# Altium schematic sheet LSM303.SchDoc: =GlobalProjectName
size A4; ApprovedBy: Утвердил; CheckedBy: Проверил; Author: Разработал; SheetNumber: 5; SheetTotal: 10; PageSetup: Record=PageOptions|CenterHorizontal=True|CenterVertical=True|PrintScale=1.00|XCorrection=1.00|YCorrection=1.00|PrintKind=1|BorderSize=5000000|LeftOffset=0|BottomOffset=0|Orientation=2|PaperLength=1000|PaperWidth=1000|Scale=100|PaperSource=15|PrintQuality=1200|MediaType=1|DitherType=10|PaperKind=A3|PrintScaleMode=1; Weight: -; ScaleFactor: -; NormInspection: Норм.Контр.
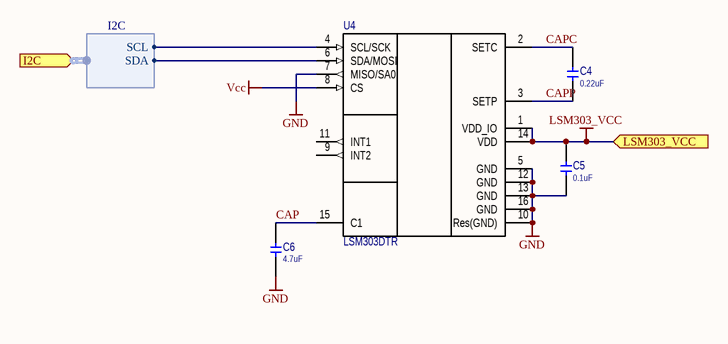
[diagram p0: LSM303.SchDoc]

## Parts
C4  value 0.22uF  [CERCAP 0402]
C5  value 0.1uF  [CERCAP 0402]
C6  value 4.7uF  [CERCAP 0603]
U4  LSM303DTR  [LGA16_LSM303DTR]

## Ports
I2C (in, harness I2C), LSM303_VCC (in)

## Harnesses
I2C: SCL, SDA

## Nets
GND: C5.1 C6.1 U4.5(GND) U4.7(MISO/SA0) U4.10(Res(GND)) U4.12(GND) U4.13(GND) U4.16(GND)
LSM303_VCC: C5.2 U4.1(VDD_IO) U4.14(VDD) ; port LSM303_VCC
Vcc: U4.8(CS)
CAP: C6.2 U4.15(C1)
CAPC: C4.2 U4.2(SETC)
CAPP: C4.1 U4.3(SETP)
NetU4_4: U4.4(SCL/SCK) ; port I2C.SCL
NetU4_6: U4.6(SDA/MOSI) ; port I2C.SDA

Not connected (* = marked no-connect by the designer): U4 9(INT2) 11(INT1)

## Notes on the sheet
- Title
- Size:
- Date:
- A4
- Number:
- Time:
- Revision:
- Sheet
- of
- File:

## Library data of the parts
C4-C6 = !Capacitor: Capacitor; IsSMT: NoSMT; Diel: X7R; Voltage: *
U4 = LSM303DTR: Acc/Mag